# Altium project AD_STM32_Practice_Project.PrjPcb
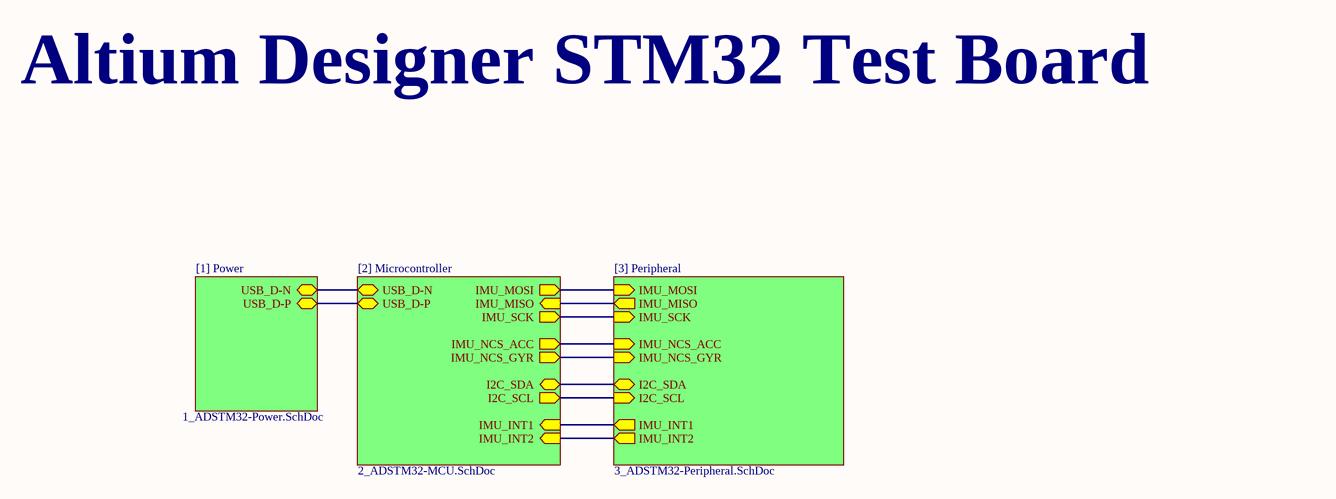
[diagram p0:  0_ADSTM32-Overview.SchDoc]
4 sheets, 30 parts. Net scope: hierarchical (ports join the sheet entries above them; power ports are global).
Board file:  ADSTM32-PCB.PcbDoc
Sheets:
   0_ADSTM32-Overview.SchDoc
   1_ADSTM32-Power.SchDoc
   2_ADSTM32-MCU.SchDoc
   3_ADSTM32-Peripheral.SchDoc

## Sheet  0_ADSTM32-Overview.SchDoc
size A; SheetNumber: 1; SheetTotal: 4

### Sub-sheets
[1] Power = 1_ADSTM32-Power.SchDoc (file not in this document): USB_D-N (bidir), USB_D-P (bidir)
[2] Microcontroller = 2_ADSTM32-MCU.SchDoc (file not in this document): USB_D-N (bidir), USB_D-P (bidir), IMU_NCS_ACC (out), IMU_NCS_GYR (out), IMU_SCK (out), IMU_MOSI (out), IMU_MISO (in), I2C_SCL (out), I2C_SDA (bidir), IMU_INT1 (in), IMU_INT2 (in)
[3] Peripheral = 3_ADSTM32-Peripheral.SchDoc (file not in this document): IMU_SCK (in), IMU_MOSI (in), IMU_MISO (out), IMU_NCS_ACC (in), IMU_NCS_GYR (in), I2C_SCL (in), I2C_SDA (bidir), IMU_INT1 (out), IMU_INT2 (out)

### Nets
(unnamed): sheet [1] Power/USB_D-N, sheet [2] Microcontroller/USB_D-N
(unnamed): sheet [1] Power/USB_D-P, sheet [2] Microcontroller/USB_D-P
(unnamed): sheet [3] Peripheral/IMU_SCK, sheet [2] Microcontroller/IMU_SCK
(unnamed): sheet [3] Peripheral/IMU_MOSI, sheet [2] Microcontroller/IMU_MOSI
(unnamed): sheet [3] Peripheral/IMU_MISO, sheet [2] Microcontroller/IMU_MISO
(unnamed): sheet [3] Peripheral/IMU_NCS_ACC, sheet [2] Microcontroller/IMU_NCS_ACC
(unnamed): sheet [3] Peripheral/IMU_NCS_GYR, sheet [2] Microcontroller/IMU_NCS_GYR
(unnamed): sheet [3] Peripheral/I2C_SCL, sheet [2] Microcontroller/I2C_SCL
(unnamed): sheet [3] Peripheral/I2C_SDA, sheet [2] Microcontroller/I2C_SDA
(unnamed): sheet [3] Peripheral/IMU_INT1, sheet [2] Microcontroller/IMU_INT1
(unnamed): sheet [3] Peripheral/IMU_INT2, sheet [2] Microcontroller/IMU_INT2

### Notes on the sheet
- Altium Designer STM32 Test Board

## Sheet  1_ADSTM32-Power.SchDoc: USB C Connector and Buck Converter
size A; SheetNumber: 2; SheetTotal: 4
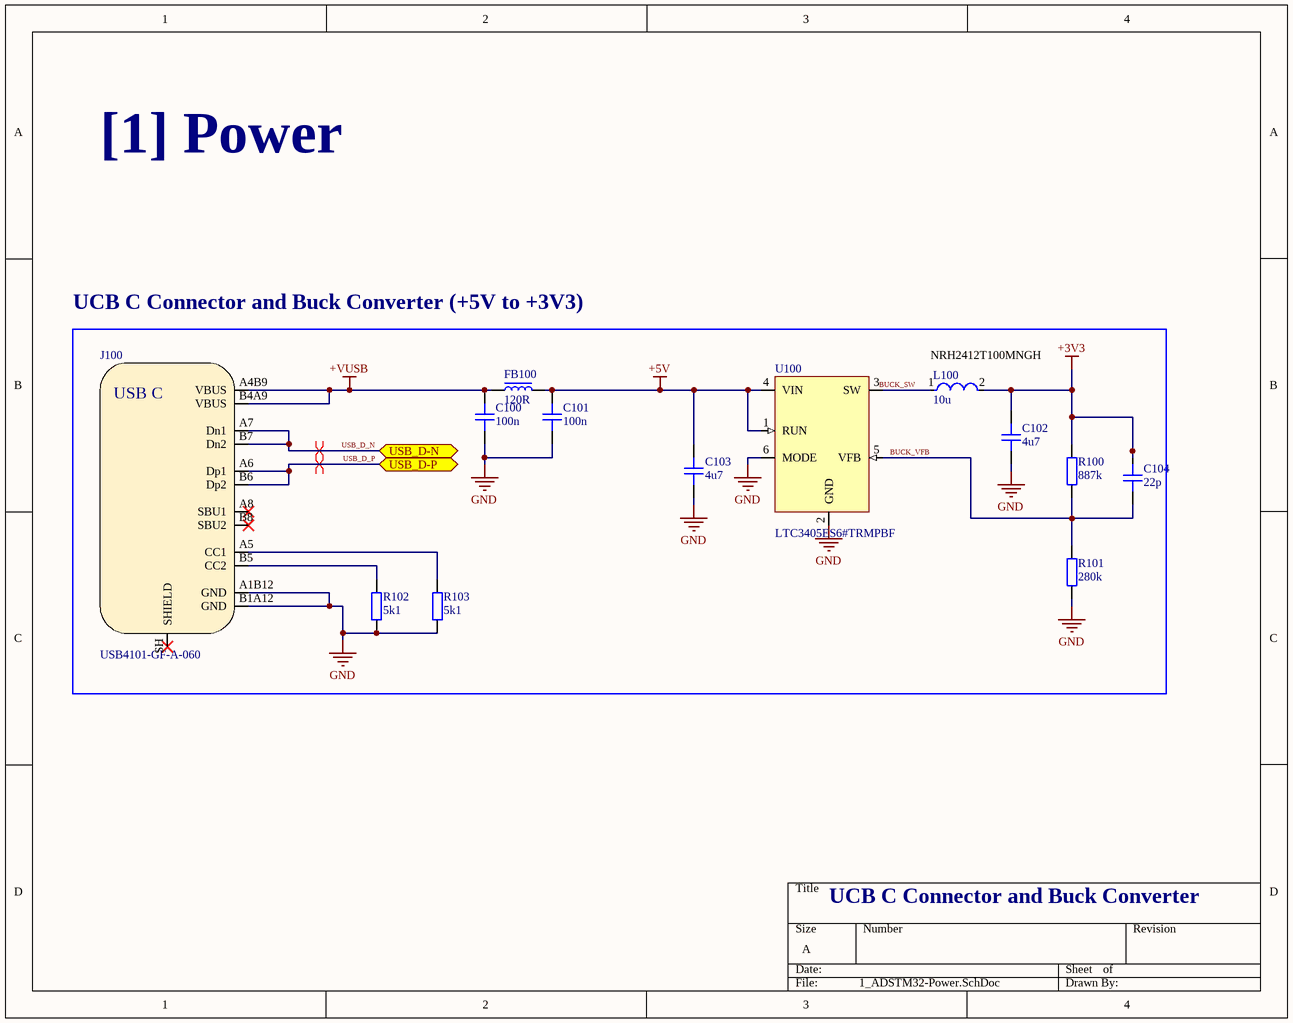
[diagram p1:  1_ADSTM32-Power.SchDoc]

### Parts
C100  100n  [CAP_0603]
C101  100n  [CAP_0603]
C102  4u7  [CAP_0805]
C103  4u7  [CAP_0805]
C104  22p  [CAP_0603]
FB100  120R  [FB_0603]
J100  USB4101-GF-A-060  [USB4105-GF-A-060]
L100  10u  [FP-NRH2412-MFG]
R100  887k  [RES_0603]
R101  280k  [RES_0603]
R102  5k1  [RES_0603]
R103  5k1  [RES_0603]
U100  LTC3405ES6#TRMPBF  [SOT-23-6]

### Ports
USB_D-N (bidir, see 0_ADSTM32-Overview[2B], 2_ADSTM32-MCU[2B]), USB_D-P (bidir, see 0_ADSTM32-Overview[2B], 2_ADSTM32-MCU[2B])

### Nets
+3V3: C102.2 C104.2 L100.2 R100.2
+5V: C101.2 C103.2 FB100.2 U100.1(RUN) U100.4(VIN)
+VUSB: C100.2 FB100.1 J100.A4B9(VBUS) J100.B4A9(VBUS)
GND: C100.1 C101.1 C102.1 C103.1 J100.A1B12(GND) J100.B1A12(GND) R101.1 R102.1 R103.1 U100.2(GND) U100.6(MODE)
BUCK_SW: L100.1 U100.3(SW)
BUCK_VFB: C104.1 R100.1 R101.2 U100.5(VFB)
USB_D_N: J100.A7(Dn1) J100.B7(Dn2) ; port USB_D-N
USB_D_P: J100.A6(Dp1) J100.B6(Dp2) ; port USB_D-P
NetJ100_A5: J100.A5(CC1) R103.2
NetJ100_B5: J100.B5(CC2) R102.2

Not connected (* = marked no-connect by the designer): J100 A8(SBU1)* B8(SBU2)* SH(SHIELD)*

### Layout directives
differential pair: USB_D_N, USB_D_P

### Notes on the sheet
- [1] Power
- UCB C Connector and Buck Converter (+5V to +3V3)
- (near L100) NRH2412T100MNGH
- UCB C Connector and Buck Converter

### Library data of the parts
C100 C101 = CAP_0603: Capaictor SMD 0603 Generic; Manufacturer: *; Manufacturer Part Number: *; Tolerance: *; Voltage Rating: *; Dielectric: *
C102 C103 = CAP_0805_16V: Capacitor SMD 0805 Generic; Voltage Rating: 16V; Manufacturer: *; Manufacturer Part Number: *; Tolerance: *; Dielectric: *
C104 = CAP_0603: Capaictor SMD 0603 Generic; Voltage Rating: 10V; Manufacturer: *; Manufacturer Part Number: *; Tolerance: *; Dielectric: *
FB100 = BMC-Q1JY0120H: Ferrite Beads BMC-Q 0603 120R 25% Tol. High Current; Manufacturer: Bourns; Impedance Value: 120 Ohm @ 100MHz; Rated Current: 1A; DC Resistance: 0.15 Ohm; Manufacturer Part Number: BMC-Q1JY0120H; Package: 0603; Supplier Link: https://eu.mouser.com/ProductDetail/TE-Connectivity-Sigma-Inductors/BMC-Q1JY0120H?qs=sGAEpiMZZMt1hubY80%2Fs8KH3ycnB7WcGc%2FcSUtObKOLmj4JvfvR2Cw%3D%3D
J100 = USB4105-GF-A-060: USB connector Type C SMT 12 pin; Manufacturer: GCT; Manufacturer Part Number: USB4105-GF-A-060; Distributor Link: https://eu.mouser.com/ProductDetail/GCT/USB4105-GF-A-060?qs=QNEnbhJQKvY2mocwNJzgfA%3D%3D
L100 = CMP-14484-000582-1: Shielded Wirewound Inductor 10uH 20% 0.51A 0.72Ω SMD; DC Resistance (DCR): 600mR; Current Rating: 450mA; Saturation Current: 810mA; Core Material: Ferrite; Test Frequency: 100kHz; Self Resonant Frequency: 29MHz; Termination: SMD/SMT; Shielding: Shielded; Height - Seated (Max): 0.047inch; Case/Package: Nonstandard; Tolerance: 20%; Height: 1.2mm; Package Quantity: 2500; Mount: Surface Mount; Min Operating Temperature: -25°C; Inductance: 10uH; Width: 0.095inch; Length: 0.095inch; RoHS Compliant: Yes; Max DC Current: 810mA; Packaging: Tape and Reel; Max Operating Temperature: 120°C; Halogen Free: Halogen Free
R100 R101 = RES_0603: Resistor SMD 0603 Generic; Tolerance: 1%; Manufacturer: *; Manufacturer Part Number: *; Package Size: *; Voltage Rating: *
R102 R103 = RES_0603: Resistor SMD 0603 Generic; Manufacturer: *; Manufacturer Part Number: *; Tolerance: *; Package Size: *; Voltage Rating: *
U100 = LTC3405ES6#TRMPBF: 1.5MHz, 300mA Synchronous Step-Down Regulator in ThinSOT; Manufacturer: Analog Devices; Panufacturer Part Number: LTC3405ES6#TRMPBF

## Sheet  2_ADSTM32-MCU.SchDoc: IMU and I2C Header
size A; SheetNumber: 3; SheetTotal: 4
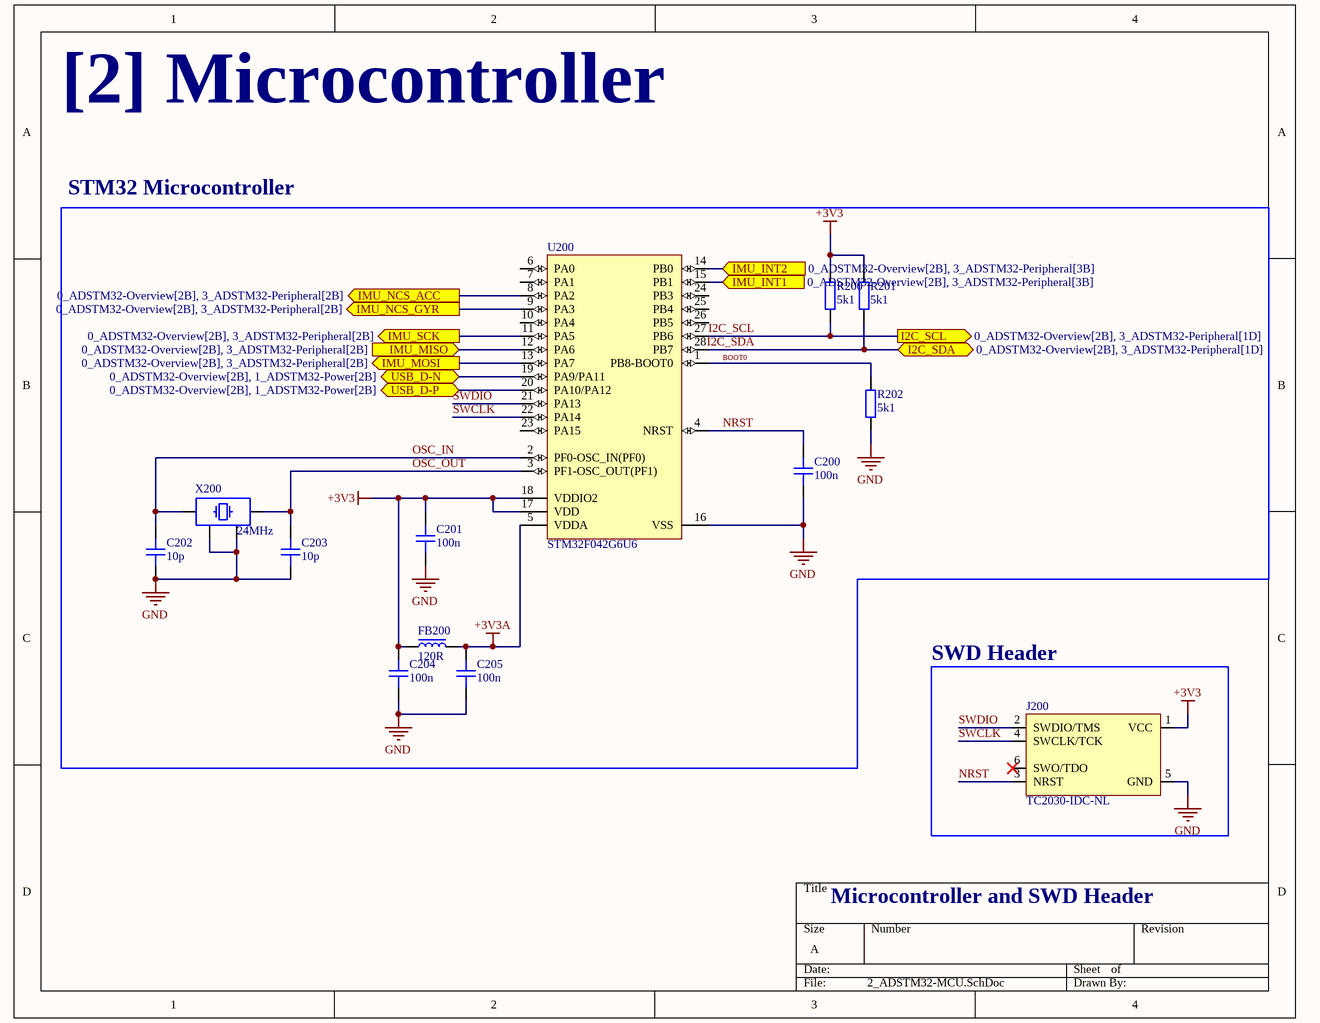
[diagram p2:  2_ADSTM32-MCU.SchDoc]

### Parts
C200  100n  [CAP_0603]
C201  100n  [CAP_0603]
C202  10p  [CAP_0603]
C203  10p  [CAP_0603]
C204  100n  [CAP_0603]
C205  100n  [CAP_0603]
FB200  120R  [FB_0603]
J200  TC2030-IDC-NL  [TC2030_NL]
R200  5k1  [RES_0603]
R201  5k1  [RES_0603]
R202  5k1  [RES_0603]
U200  STM32F042G6U6  [STM-UFQFPN28_V]
X200  24MHz  [XTAL_3225]

### Blocks framed on the sheet
STM32 Microcontroller: C200-C205 FB200 R200-R202 U200 X200
SWD Header: J200

### Ports
I2C_SCL (out, see 0_ADSTM32-Overview[2B], 3_ADSTM32-Peripheral[1D]), I2C_SDA (bidir, see 0_ADSTM32-Overview[2B], 3_ADSTM32-Peripheral[1D]), IMU_INT1 (in, see 0_ADSTM32-Overview[2B], 3_ADSTM32-Peripheral[3B]), IMU_INT2 (in, see 0_ADSTM32-Overview[2B], 3_ADSTM32-Peripheral[3B]), IMU_MISO (in, see 0_ADSTM32-Overview[2B], 3_ADSTM32-Peripheral[2B]), IMU_MOSI (out, see 0_ADSTM32-Overview[2B], 3_ADSTM32-Peripheral[2B]), IMU_NCS_ACC (out, see 0_ADSTM32-Overview[2B], 3_ADSTM32-Peripheral[2B]), IMU_NCS_GYR (out, see 0_ADSTM32-Overview[2B], 3_ADSTM32-Peripheral[2B]), IMU_SCK (out, see 0_ADSTM32-Overview[2B], 3_ADSTM32-Peripheral[2B]), USB_D-N (bidir, see 0_ADSTM32-Overview[2B], 1_ADSTM32-Power[2B]), USB_D-P (bidir, see 0_ADSTM32-Overview[2B], 1_ADSTM32-Power[2B])

### Nets
+3V3: C201.2 C204.2 FB200.1 J200.1(VCC) R200.2 R201.2 U200.17(VDD) U200.18(VDDIO2)
+3V3A: C205.2 FB200.2 U200.5(VDDA)
GND: C200.1 C201.1 C202.1 C203.1 C204.1 C205.1 J200.5(GND) R202.1 U200.16(VSS) X200.2(GND) X200.4(GND)
BOOT0: R202.2 U200.1(PB8-BOOT0)
I2C_SCL: R200.1 U200.27(PB6) ; port I2C_SCL
I2C_SDA: R201.1 U200.28(PB7) ; port I2C_SDA
NRST: C200.2 J200.3(NRST) U200.4(NRST)
OSC_IN: C202.2 U200.2(PF0-OSC_IN(PF0)) X200.1(X1)
OSC_OUT: C203.2 U200.3(PF1-OSC_OUT(PF1)) X200.3(X2)
SWCLK: J200.4(SWCLK/TCK) U200.22(PA14)
SWDIO: J200.2(SWDIO/TMS) U200.21(PA13)
NetU200_8: U200.8(PA2) ; port IMU_NCS_ACC
NetU200_9: U200.9(PA3) ; port IMU_NCS_GYR
NetU200_11: U200.11(PA5) ; port IMU_SCK
NetU200_12: U200.12(PA6) ; port IMU_MISO
NetU200_13: U200.13(PA7) ; port IMU_MOSI
NetU200_14: U200.14(PB0) ; port IMU_INT2
NetU200_15: U200.15(PB1) ; port IMU_INT1
NetU200_19: U200.19(PA9/PA11) ; port USB_D-N
NetU200_20: U200.20(PA10/PA12) ; port USB_D-P

Not connected (* = marked no-connect by the designer): J200 6(SWO/TDO)*; U200 6(PA0) 7(PA1) 10(PA4) 23(PA15) 24(PB3) 25(PB4) 26(PB5)

### Notes on the sheet
- [2] Microcontroller
- Microcontroller and SWD Header

### Library data of the parts
C200-C205 = CAP_0603: Capaictor SMD 0603 Generic; Manufacturer: *; Manufacturer Part Number: *; Tolerance: *; Voltage Rating: *; Dielectric: *
FB200 = BMC-Q1JY0120H: as FB100 on sheet  1_ADSTM32-Power; Manufacturer Part Number: BMC-Q1JY0120H; Package: 0603; Supplier Link: https://eu.mouser.com/ProductDetail/TE-Connectivity-Sigma-Inductors/BMC-Q1JY0120H?qs=sGAEpiMZZMt1hubY80%2Fs8KH3ycnB7WcGc%2FcSUtObKOLmj4JvfvR2Cw%3D%3D
J200 = TC2030-IDC-NL: Tag-Connect No-Solder SWD Debug Connector (No Legs); Manufactrer: Tag Connect; Manufacturer Part Number: TC2030-IDC-NL
R200-R202 = RES_0603: Resistor SMD 0603 Generic; Manufacturer: *; Manufacturer Part Number: *; Tolerance: *; Package Size: *; Voltage Rating: *
U200 = CMP-0304-00112-2: ARM Cortex-M0 32-bit MCU, 32 KB Flash, 6 KB Internal RAM, 24 I/Os, 28-Pin UFQFPN, -40 to 85 degC, Tray; Manufacturer: STMicroelectronics; FLASH Size (Prog) (kB): 32; I/Os (High Current): 24; Internal RAM Size (kB): 6; Supply Voltage(Vcc) min (V): 2; Operating Frequency(F) (Processor speed) (MHz): 48; Core: ARM Cortex-M0; PartNumber: STM32F042G6U6; Packing: Tray; Package Description: 28-Pin Ultra Thin Fine Pitch Quad Flat No-Lead, 4 x 4 x 0.6 mm Body, 0.5 mm Pitch; ComponentLink2Description: Datasheet; ComponentLink1Description: Manufacturer URL; Package Reference: UFQFPN28; DatasheetVersion: Rev. 5; ComponentLink1URL: http://www.st.com/; ComponentLink2URL: http://www.st.com/st-web-ui/static/active/en/resource/technical/document/datasheet/DM00105814.pdf; Mounting Technology: Surface Mount
X200 = TSX-3225_24.0000MF20G-AC3: Crystal SMD 24MHz 10PPM 9pF; Manufacturer: Epson; Manufacturer Part Number: TSX-3225_24.0000MF20G-AC3; LCSC: *; Supplier Link: https://www.mouser.co.uk/ProductDetail/Epson-Timing/TSX-3225-24.0000MF20G-AC3?qs=tC2qD9afNgou1YHpctmuPA%3D%3D&srsltid=AfmBOoouiOfIznH0zW1dtqsynOn3XHi3SewUDh2izLsmfH-7_t8qZOyb

## Sheet  3_ADSTM32-Peripheral.SchDoc
size A; SheetNumber: 4; SheetTotal: 4
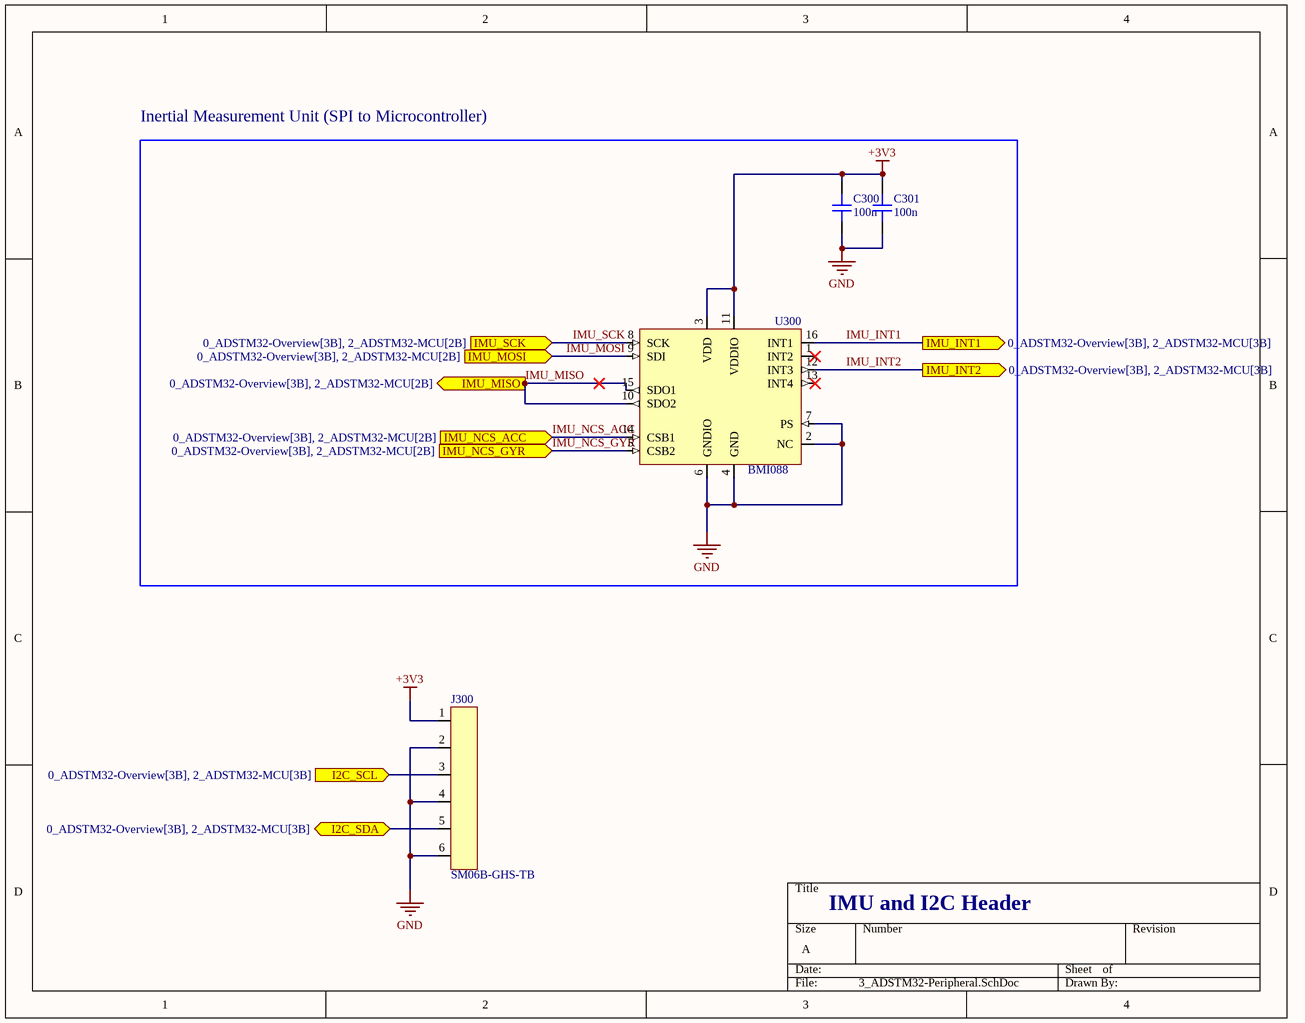
[diagram p3:  3_ADSTM32-Peripheral.SchDoc]

### Parts
C300  100n  [CAP_0603]
C301  100n  [CAP_0603]
J300  SM06B-GHS-TB  [SM06B-GHS-TB]
U300  BMI088  [BMI088]

### Blocks framed on the sheet
Inertial Measurement Unit (SPI to Microcontroller): C300 C301 U300

### Ports
I2C_SCL (in, see 0_ADSTM32-Overview[3B], 2_ADSTM32-MCU[3B]), I2C_SDA (bidir, see 0_ADSTM32-Overview[3B], 2_ADSTM32-MCU[3B]), IMU_INT1 (out, see 0_ADSTM32-Overview[3B], 2_ADSTM32-MCU[3B]), IMU_INT2 (out, see 0_ADSTM32-Overview[3B], 2_ADSTM32-MCU[3B]), IMU_MISO (out, see 0_ADSTM32-Overview[3B], 2_ADSTM32-MCU[2B]), IMU_MOSI (in, see 0_ADSTM32-Overview[3B], 2_ADSTM32-MCU[2B]), IMU_NCS_ACC (in, see 0_ADSTM32-Overview[3B], 2_ADSTM32-MCU[2B]), IMU_NCS_GYR (in, see 0_ADSTM32-Overview[3B], 2_ADSTM32-MCU[2B]), IMU_SCK (in, see 0_ADSTM32-Overview[3B], 2_ADSTM32-MCU[2B])

### Nets
+3V3: C300.2 C301.2 J300.1 U300.3(VDD) U300.11(VDDIO)
GND: C300.1 C301.1 J300.2 J300.4 J300.6 U300.2(NC) U300.4(GND) U300.6(GNDIO) U300.7(PS)
IMU_INT1: U300.16(INT1) ; port IMU_INT1
IMU_INT2: U300.12(INT3) ; port IMU_INT2
IMU_MISO: U300.10(SDO2) U300.15(SDO1) ; port IMU_MISO
IMU_MOSI: U300.9(SDI) ; port IMU_MOSI
IMU_NCS_ACC: U300.14(CSB1) ; port IMU_NCS_ACC
IMU_NCS_GYR: U300.5(CSB2) ; port IMU_NCS_GYR
IMU_SCK: U300.8(SCK) ; port IMU_SCK
NetJ300_3: J300.3 ; port I2C_SCL
NetJ300_5: J300.5 ; port I2C_SDA

Not connected (* = marked no-connect by the designer): U300 1(INT2)* 13(INT4)*

### Notes on the sheet
- IMU and I2C Header

### Library data of the parts
C300 C301 = CAP_0603: Capaictor SMD 0603 Generic; Manufacturer: *; Manufacturer Part Number: *; Tolerance: *; Voltage Rating: *; Dielectric: *
J300 = SM06B-GHS-TB: Header Connector 6 Position 1.25MM Pitch SMD Horizontal JST GH; Manufacturer: JST; Manufacturer Part Number: SM06B-GHS-TB; Distributor Link 1: https://www.digikey.co.uk/en/products/detail/jst-sales-america-inc/SM06B-GHS-TB/807790?srsltid=AfmBOopuWliyuZMmwFQasP26N8UGWQ-544t8Du2hpq1pUTE7HfB37_20; Distributor Link 2: https://eu.mouser.com/ProductDetail/JST-Commercial/SM06B-GHS-TBLFSN?qs=dbcCsuKDzFVtzW8gaymizQ==&srsltid=AfmBOopZ7IaGkbagz-tGgYVZR08OuGz3rY7I5JdStK1xvGH3CZodfjQn&_gl=1*1e23q4v*_ga*dW5kZWZpbmVk*_ga_15W4STQT4T*dW5kZWZpbmVk*_ga_1KQLCYKRX3*dW5kZWZpbmVk
U300 = BMI088: Inertial Measurement Unit (IMU) 6-axis 16bit; Manufacturer: Bosch; Manufacturer Part Number: BMI088; Distributor link: https://eu.mouser.com/ProductDetail/Bosch-Sensortec/BMI088?qs=f9yNj16SXrIMFspTV6RB6Q%3D%3D

## Nets that join several sheets
+3V3:  1_ADSTM32-Power (C102.2 C104.2 L100.2 R100.2),  2_ADSTM32-MCU (8 pins),  3_ADSTM32-Peripheral (5 pins)
GND:  1_ADSTM32-Power (11 pins),  2_ADSTM32-MCU (11 pins),  3_ADSTM32-Peripheral (9 pins)